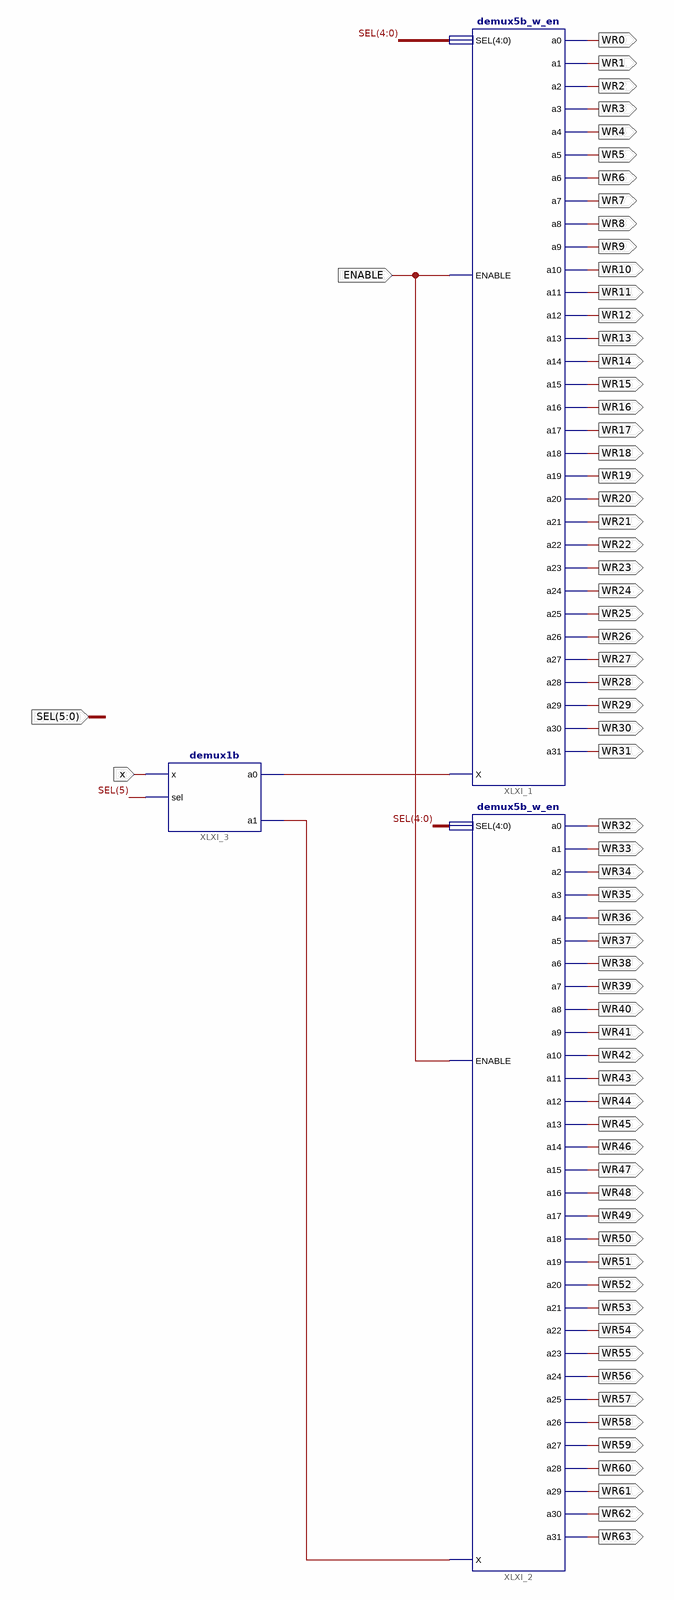
[diagram p0: schematic sheet 1]
// Xilinx ISE schematic demux6b_w_en.sch (artix7) as structural Verilog: 3 symbols, 67 ports
module demux6b_w_en (
  input  ENABLE,
  input  x,
  input  [5:0] SEL,
  output WR0,
  output WR1,
  output WR2,
  output WR3,
  output WR4,
  output WR5,
  output WR6,
  output WR7,
  output WR8,
  output WR9,
  output WR10,
  output WR11,
  output WR12,
  output WR13,
  output WR14,
  output WR15,
  output WR16,
  output WR17,
  output WR18,
  output WR19,
  output WR20,
  output WR21,
  output WR22,
  output WR23,
  output WR24,
  output WR25,
  output WR26,
  output WR27,
  output WR28,
  output WR29,
  output WR30,
  output WR31,
  output WR32,
  output WR33,
  output WR34,
  output WR35,
  output WR36,
  output WR37,
  output WR38,
  output WR39,
  output WR40,
  output WR41,
  output WR42,
  output WR43,
  output WR44,
  output WR45,
  output WR46,
  output WR47,
  output WR48,
  output WR49,
  output WR50,
  output WR51,
  output WR52,
  output WR53,
  output WR54,
  output WR55,
  output WR56,
  output WR57,
  output WR58,
  output WR59,
  output WR60,
  output WR61,
  output WR62,
  output WR63
);

  wire XLXN_1, XLXN_2;

  demux5b_w_en XLXI_1 (
    .ENABLE(ENABLE), .SEL(SEL[4:0]), .a0(WR0), .a1(WR1), .a2(WR2), .a3(WR3), .a4(WR4), .a5(WR5), .a6(WR6),
    .a7(WR7), .a8(WR8), .a9(WR9), .a10(WR10), .a11(WR11), .a12(WR12), .a13(WR13), .a14(WR14), .a15(WR15),
    .a16(WR16), .a17(WR17), .a18(WR18), .a19(WR19), .a20(WR20), .a21(WR21), .a22(WR22), .a23(WR23),
    .a24(WR24), .a25(WR25), .a26(WR26), .a27(WR27), .a28(WR28), .a29(WR29), .a30(WR30), .a31(WR31), .X(XLXN_1));
  demux5b_w_en XLXI_2 (
    .ENABLE(ENABLE), .SEL(SEL[4:0]), .a0(WR32), .a1(WR33), .a2(WR34), .a3(WR35), .a4(WR36), .a5(WR37),
    .a6(WR38), .a7(WR39), .a8(WR40), .a9(WR41), .a10(WR42), .a11(WR43), .a12(WR44), .a13(WR45), .a14(WR46),
    .a15(WR47), .a16(WR48), .a17(WR49), .a18(WR50), .a19(WR51), .a20(WR52), .a21(WR53), .a22(WR54),
    .a23(WR55), .a24(WR56), .a25(WR57), .a26(WR58), .a27(WR59), .a28(WR60), .a29(WR61), .a30(WR62),
    .a31(WR63), .X(XLXN_2));
  demux1b XLXI_3 (.x(x), .sel(SEL[5]), .a0(XLXN_1), .a1(XLXN_2));
endmodule
